# EAGLE schematic ESE323- 100kHz Oscilloscope Project_ (EAGLE 9.7.0)

## Sheet 1 of 4
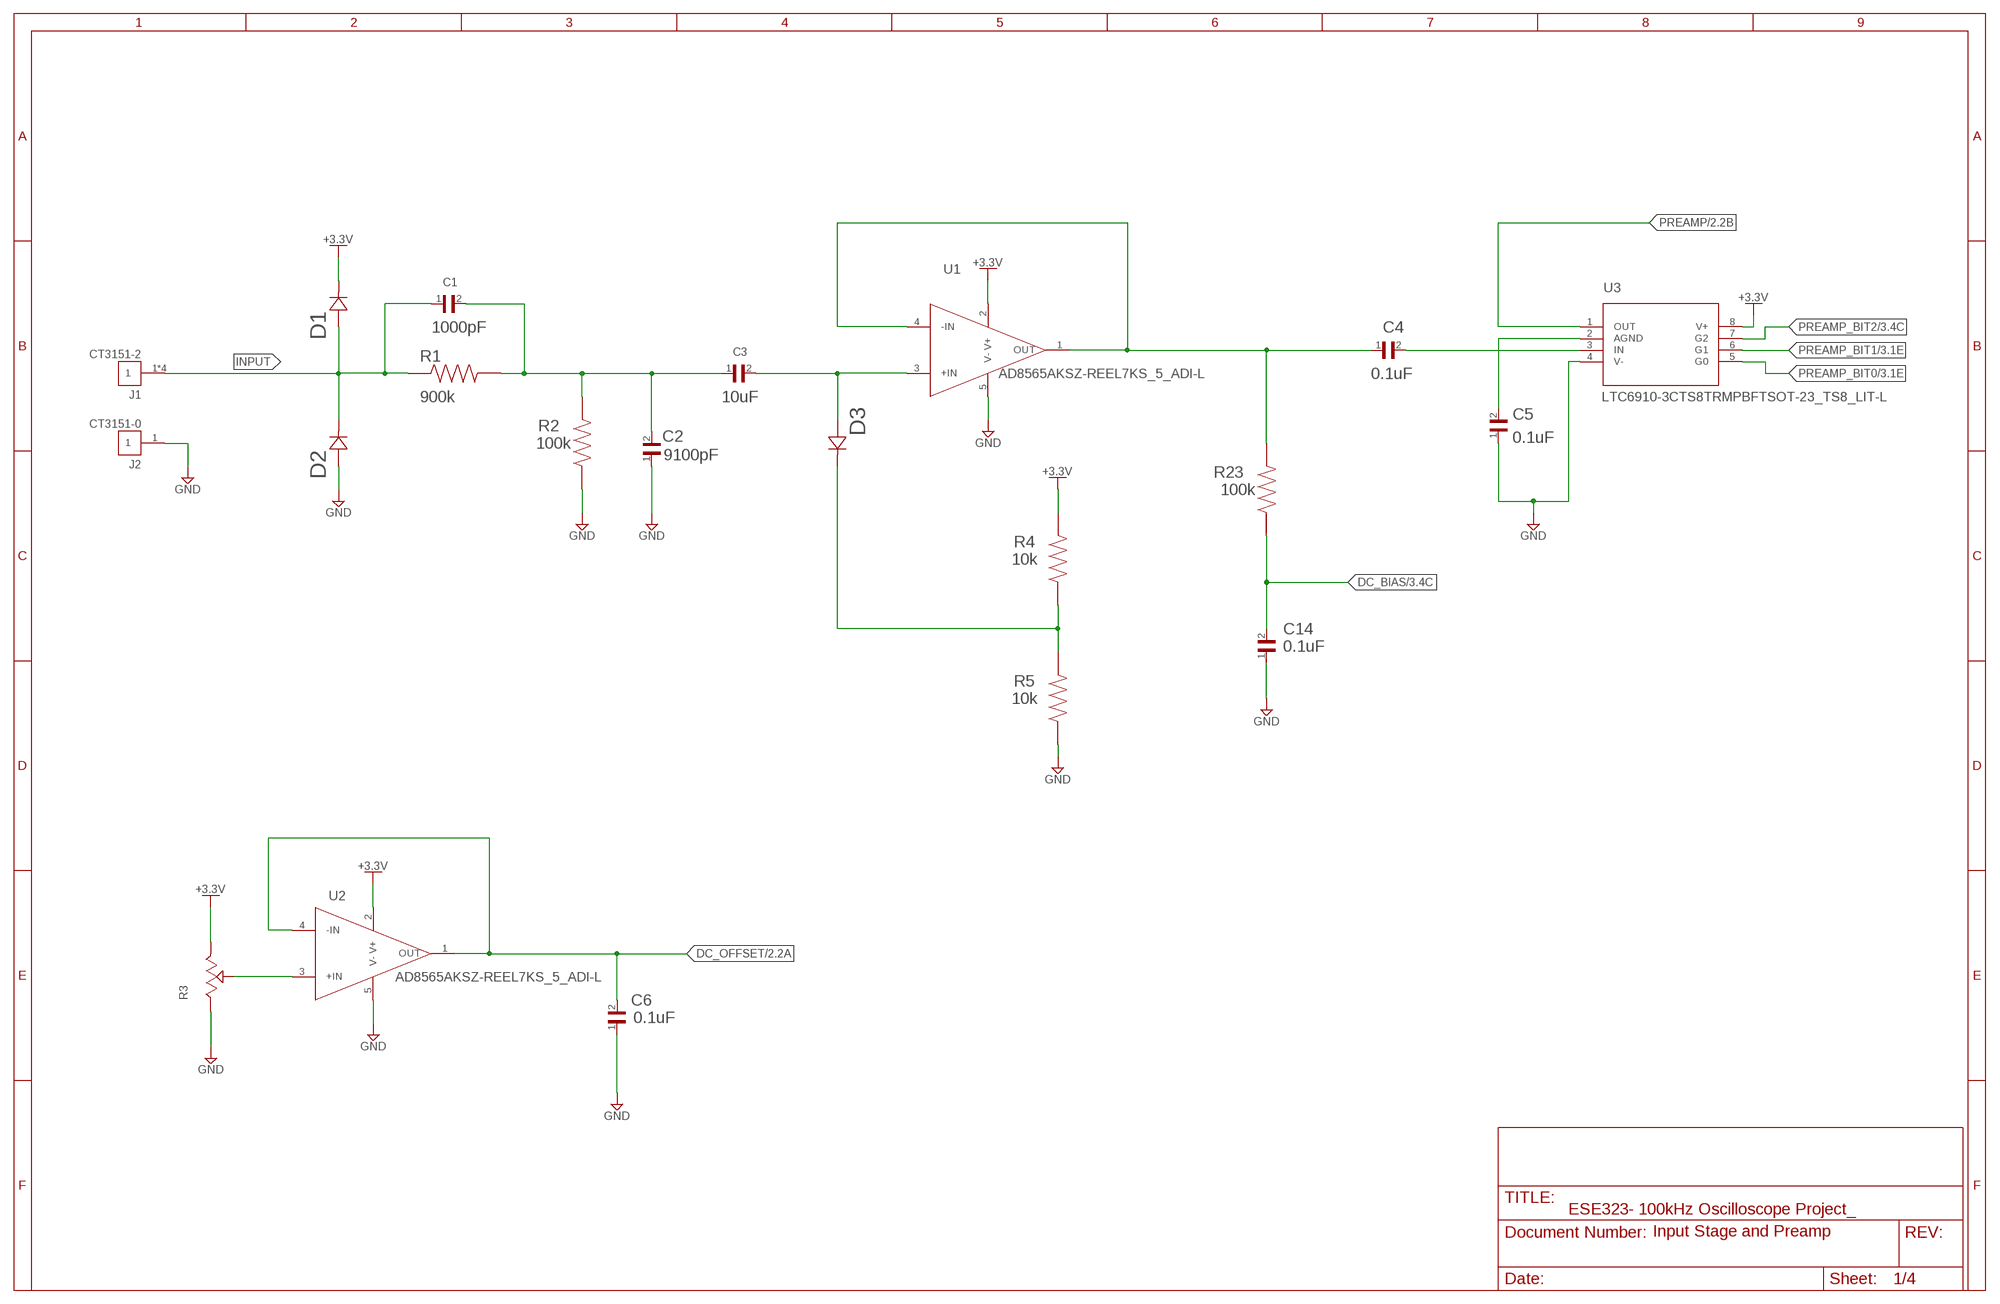
[diagram p0: schematic, sheet 1]

### Parts
C1  GRM2165C2A102JA01D  [GRM2165C2A102JA01D]
C2  GRM2195C1H912JA01D  [GRM2195C1H912JA01D]
C3  GRM188R61A106ME69D  [GRM188R61A106ME69D]
C4  GCJ188R71H104KA12D  [GCJ188R71H104KA12D]
C5  GRT188R61H105KE13D  [GCJ188R71H104KA12D]
C6  GCJ188R71H104KA12D  [GCJ188R71H104KA12D]
C14  GCJ188R71H104KA12D  [GCJ188R71H104KA12D]
D1  NSR05F40NXT5GCR_NSR05_ONS-L  [CR_NSR05_ONS-L]
D2  NSR05F40NXT5GCR_NSR05_ONS-L  [CR_NSR05_ONS-L]
D3  NSR05F40NXT5GCR_NSR05_ONS-L  [CR_NSR05_ONS-L]
J1  CT3151-2  [CALTEST_CT3151-2]
J2  CT3151-0  [CALTEST_CT3151-0]
R1  RT1206CRE07900KL  [RT1206CRE07900KL]
R2  ESR03EZPJ104  [ESR03EZPJ103]
R3  3386P-1-101TLF  [TRIM_3386P-1-101TLF]
R4  ESR03EZPJ103  [ESR03EZPJ103]
R5  ESR03EZPJ103  [ESR03EZPJ103]
R23  ESR03EZPJ104  [ESR03EZPJ103]
U1  AD8565AKSZ-REEL7KS_5_ADI-L  [AD8565-L]
U2  AD8565AKSZ-REEL7KS_5_ADI-L  [AD8565-L]
U3  LTC6910-3CTS8TRMPBFTSOT-23_TS8_LIT-L  [LTC6910-4-TSOT-23-L]

### Nets
+3.3V: D1.1 R3.3(CW) R4.2 U1.2(V+) U2.2(V+) U3.8(V+) ; also sheet 2,3,4
DC_BIAS: C14.2 R23.1 ; also sheet 3
DC_OFFSET: C6.2 U2.1(OUT) U2.4(-IN) ; also sheet 2,3
GND: C2.1 C5.1 C6.1 C14.1 D2.2 J2.1 R2.1 R3.1(CCW) R5.1 U1.5(V-) U2.5(V-) U3.4(V-) ; also sheet 2,3,4
INPUT: C1.1 D1.2 D2.1 J1.1 J1.2 J1.3 J1.4 R1.1
N$1: C4.2 U3.3(IN)
N$2: C3.2 D3.2 U1.3(+IN)
N$5: R3.2(WIPER) U2.3(+IN)
N$9: C1.2 C2.2 C3.1 R1.2 R2.2
N$10: C5.2 U3.2(AGND)
N$16: D3.1 R4.1 R5.2
N$23: C4.1 R23.2 U1.1(OUT) U1.4(-IN)
PREAMP: U3.1(OUT) ; also sheet 2
PREAMP_BIT0: U3.5(G0) ; also sheet 3
PREAMP_BIT1: U3.6(G1) ; also sheet 3
PREAMP_BIT2: U3.7(G2) ; also sheet 3

### Notes on the sheet
- 1000pF
- 0.1uF
- 900k | 10uF
- 0.1uF
- 100k
- 9100pF
- 100k
- 10k
- 0.1uF
- 10k
- 0.1uF
- Input Stage and Preamp

## Sheet 2 of 4
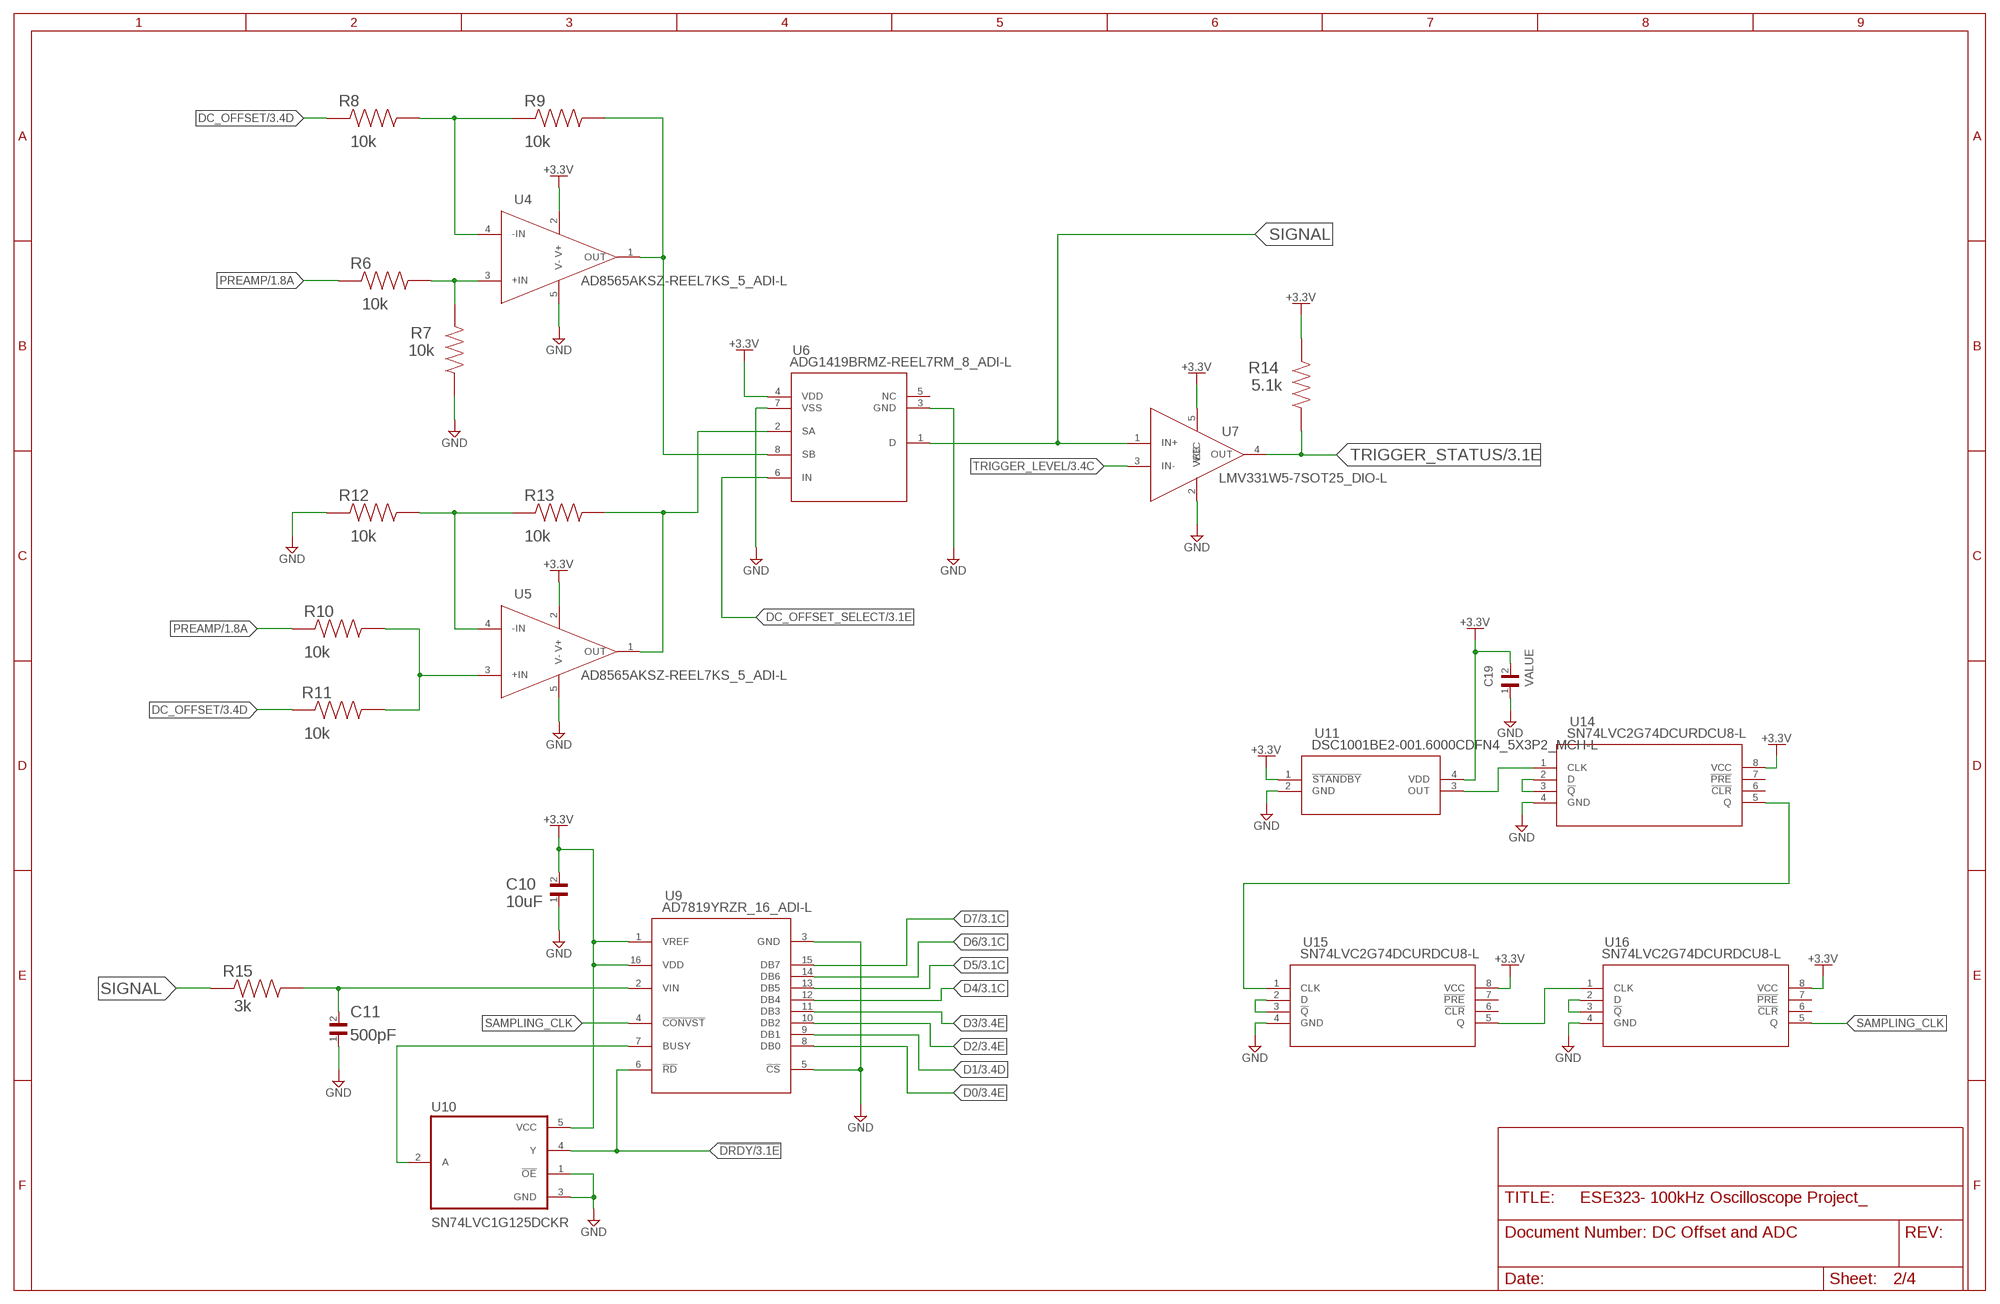
[diagram p1: schematic, sheet 2]

### Parts
C10  GRM188R61A106ME69D  [GRM188R61A106ME69D]
C11  CC0603JRNPO9BN501  [CC0603JRNPO9BN501]
C19  GCJ188R71H104KA12D  [GCJ188R71H104KA12D]
R6  ESR03EZPJ103  [ESR03EZPJ103]
R7  ESR03EZPJ103  [ESR03EZPJ103]
R8  ESR03EZPJ103  [ESR03EZPJ103]
R9  ESR03EZPJ103  [ESR03EZPJ103]
R10  ESR03EZPJ103  [ESR03EZPJ103]
R11  ESR03EZPJ103  [ESR03EZPJ103]
R12  ESR03EZPJ103  [ESR03EZPJ103]
R13  ESR03EZPJ103  [ESR03EZPJ103]
R14  RT0603DRE075K1L  [ESR03EZPJ103]
R15  ESR03EZPJ302  [ESR03EZPJ103]
U4  AD8565AKSZ-REEL7KS_5_ADI-L  [AD8565-L]
U5  AD8565AKSZ-REEL7KS_5_ADI-L  [AD8565-L]
U6  ADG1419BRMZ-REEL7RM_8_ADI-L  [ADG1419-L]
U7  LMV331W5-7SOT25_DIO-L  [LMV331-L]
U9  AD7819YRZR_16_ADI-L  [AD7819-L]
U10  SN74LVC1G125DCKR  [SN74LVC1G125DCKR-SOT65P210X110-5N]
U11  DSC1001BE2-001.6000CDFN4_5X3P2_MCH-L  [CDFN4_5X3P2_MCH-L]
U14  SN74LVC2G74DCURDCU8-L  [DCU8-L]
U15  SN74LVC2G74DCURDCU8-L  [DCU8-L]
U16  SN74LVC2G74DCURDCU8-L  [DCU8-L]

### Nets
!DRDY: U9.6(!RD) U10.4(Y) ; also sheet 3
+3.3V: C10.2 C19.2 R14.2 U4.2(V+) U5.2(V+) U6.4(VDD) U7.5(VCC) U9.1(VREF) U9.16(VDD) U10.5(VCC) U11.1(!STANDBY) U11.4(VDD) U14.8(VCC) U15.8(VCC) U16.8(VCC) ; also sheet 1,3,4
D0: U9.8(DB0) ; also sheet 3
D1: U9.9(DB1) ; also sheet 3
D2: U9.10(DB2) ; also sheet 3
D3: U9.11(DB3) ; also sheet 3
D4: U9.12(DB4) ; also sheet 3
D5: U9.13(DB5) ; also sheet 3
D6: U9.14(DB6) ; also sheet 3
D7: U9.15(DB7) ; also sheet 3
DC_OFFSET: R8.1 R11.1 ; also sheet 1,3
DC_OFFSET_SELECT: U6.6(IN) ; also sheet 3,4
GND: C10.1 C11.1 C19.1 R7.1 R12.1 U4.5(V-) U5.5(V-) U6.3(GND) U6.7(VSS) U7.2(VEE) U9.3(GND) U9.5(!CS) U10.1(!OE) U10.3(GND) U11.2(GND) U14.4(GND) U15.4(GND) U16.4(GND) ; also sheet 1,3,4
N$4: R6.2 R7.2 U4.3(+IN)
N$11: R8.2 R9.1 U4.4(-IN)
N$13: R10.2 R11.2 U5.3(+IN)
N$14: R12.2 R13.1 U5.4(-IN)
N$15: R9.2 U4.1(OUT) U6.8(SB)
N$17: R13.2 U5.1(OUT) U6.2(SA)
N$25: C11.2 R15.2 U9.2(VIN)
N$26: U9.7(BUSY) U10.2(A)
N$29: U14.2(D) U14.3(!Q)
N$30: U15.2(D) U15.3(!Q)
N$31: U16.2(D) U16.3(!Q)
N$32: U11.3(OUT) U14.1(CLK)
N$33: U14.5(Q) U15.1(CLK)
N$34: U15.5(Q) U16.1(CLK)
PREAMP: R6.1 R10.1 ; also sheet 1
SAMPLING_CLK: U9.4(!CONVST) U16.5(Q)
SIGNAL: R15.1 U6.1(D) U7.1(IN+)
TRIGGER_LEVEL: U7.3(IN-) ; also sheet 3,4
TRIGGER_STATUS: R14.1 U7.4(OUT) ; also sheet 3
Unconnected: U6.5(NC) U14.6(!CLR) U14.7(!PRE) U15.6(!CLR) U15.7(!PRE) U16.6(!CLR) U16.7(!PRE)

### Notes on the sheet
- 10k | 10k
- 10k
- 10k
- 5.1k
- 10k | 10k
- 10k
- 10k
- 10uF
- 3k
- 500pF
- DC Offset and ADC

## Sheet 3 of 4
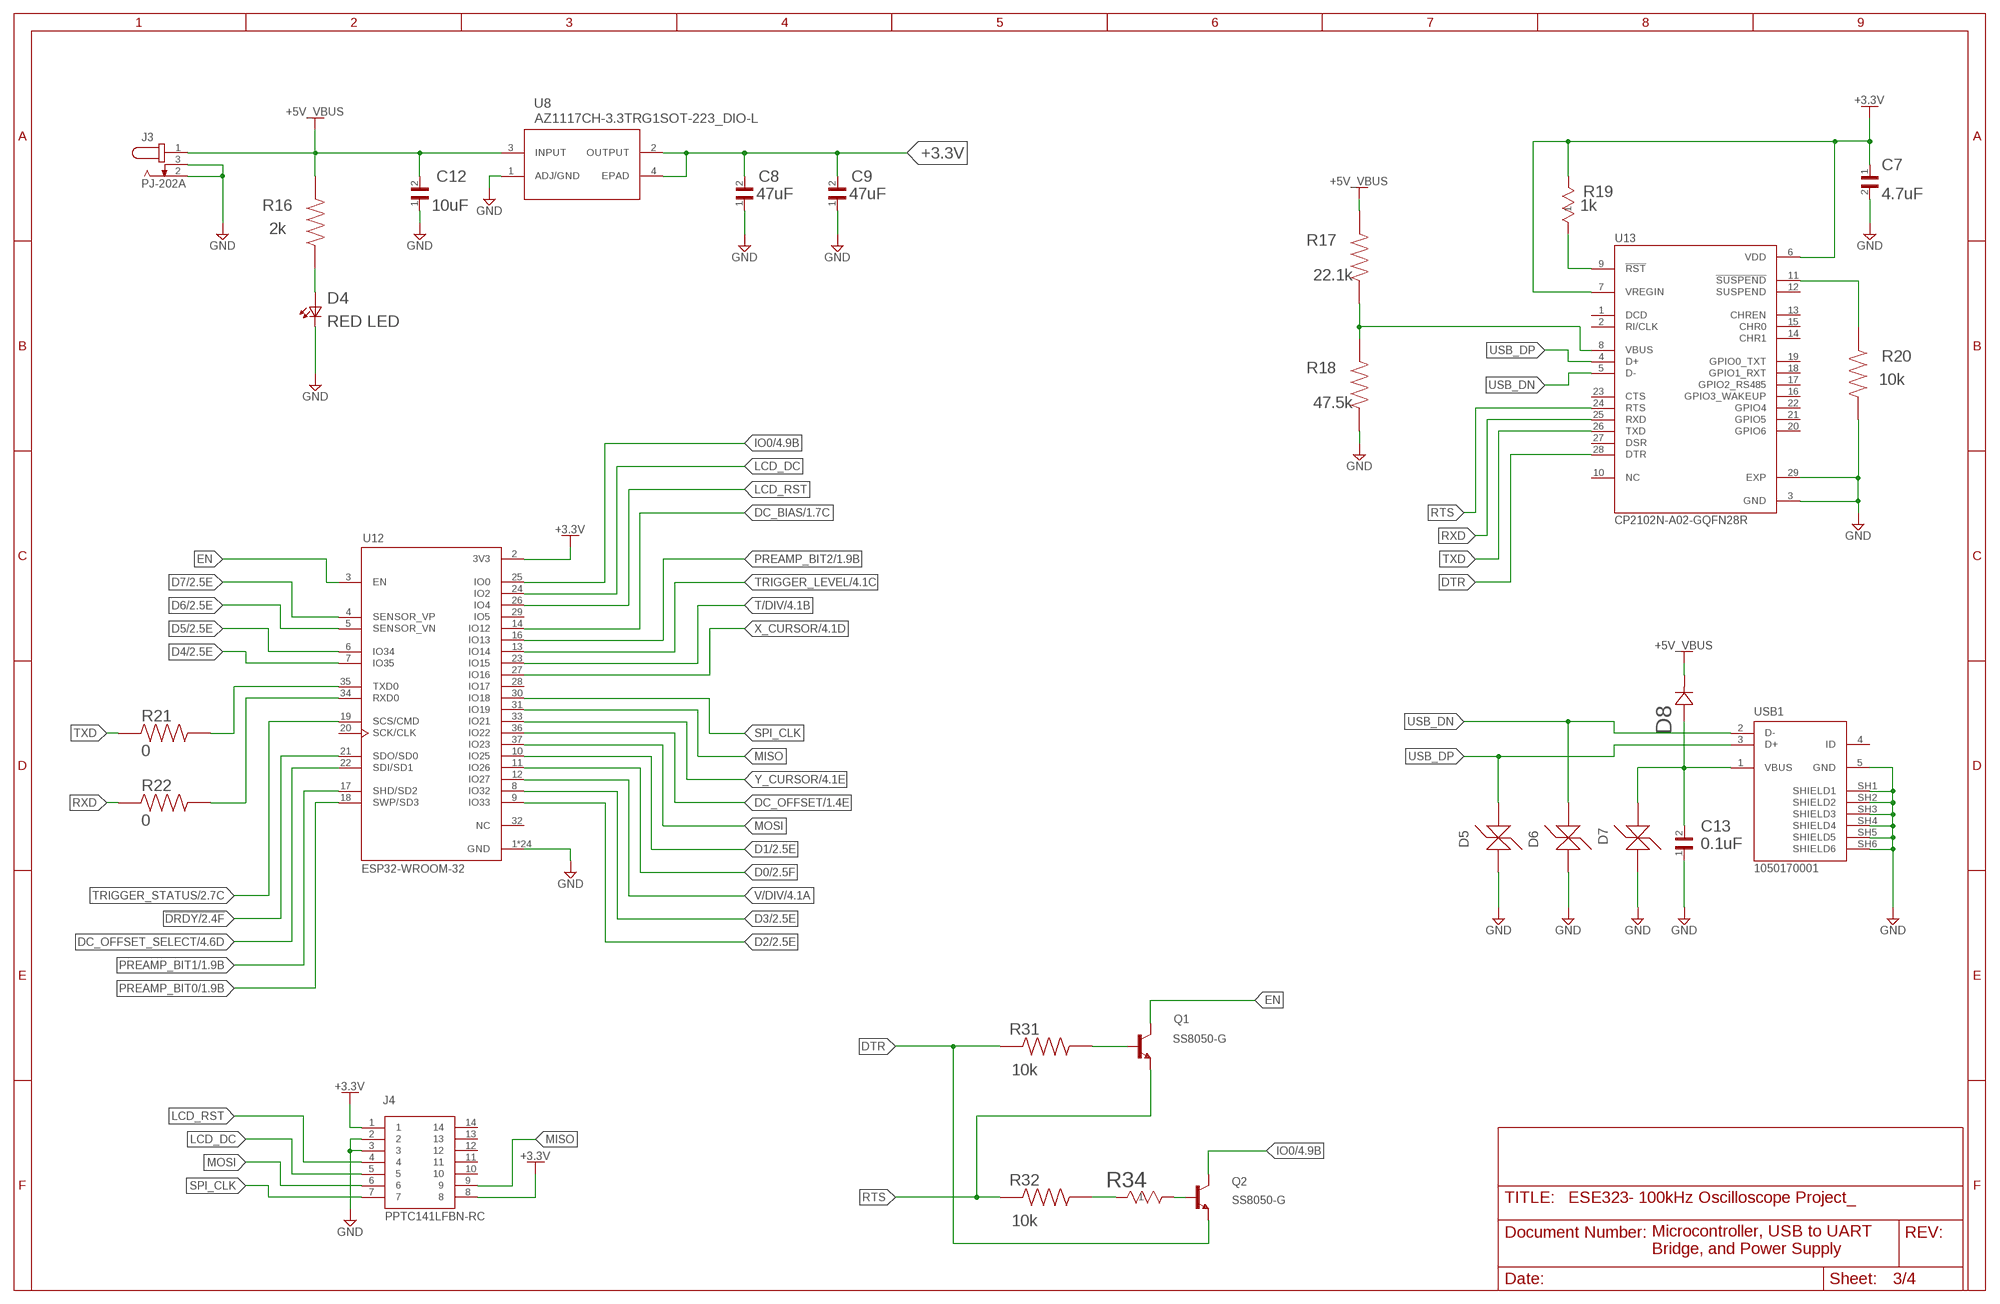
[diagram p2: schematic, sheet 3]

### Parts
C7  C0603C475K9PACTU  [CAPC1608X90]
C8  GRM188R60J476ME15J  [GRM188R60J476ME15J]
C9  GRM188R60J476ME15J  [GRM188R60J476ME15J]
C12  GRM188R61A106ME69D  [GRM188R61A106ME69D]
C13  GCJ188R71H104KA12D  [GCJ188R71H104KA12D]
D4  LTST-C191KRKT  [LTST-C191KRKT-0603]
D5  D5V0L1B2T-7SOD523_DIO-L  [D5V0L1B2T_7-SOD523_DIO-L]
D6  D5V0L1B2T-7SOD523_DIO-L  [D5V0L1B2T_7-SOD523_DIO-L]
D7  D5V0L1B2T-7SOD523_DIO-L  [D5V0L1B2T_7-SOD523_DIO-L]
D8  NSR05F40NXT5GCR_NSR05_ONS-L  [CR_NSR05_ONS-L]
J3  PJ-202A  [CUI_PJ-202A]
J4  PPTC141LFBN-RC  [PPTC141LFBN-RC]
Q1  SS8050-G  [TRANS_SS8050-G]
Q2  SS8050-G  [TRANS_SS8050-G]
R16  ESR03EZPJ202  [ESR03EZPJ202]
R17  RNCP0603FTD22K1  [RNCP0603FTD22K1]
R18  RNCF0603DTE47K5  [RNCF0603DTE47K5]
R19  RNCP0603FTD1K00STA_RNCP0603_STP-L  [STA_RNCP0603_STP-L]
R20  ESR03EZPJ103  [ESR03EZPJ103]
R21  RMCF0603ZT0R00  [RMCF0603ZT0R00]
R22  RMCF0603ZT0R00  [RMCF0603ZT0R00]
R31  ESR03EZPJ103  [ESR03EZPJ103]
R32  ESR03EZPJ103  [ESR03EZPJ103]
R34  CD14ZT0R00STA_CD14_STP  [STA_CD14_STP]
U8  AZ1117CH-3.3TRG1SOT-223_DIO-L  [AZ1117CH-3.3TRG1-SOT-223_DIO-L]
U12  ESP32-WROOM-32  [MODULE_ESP32-WROOM-32]
U13  CP2102N-A02-GQFN28R  [IC_CP2102N-A02-GQFN28R]
USB1  1050170001  [MOLEX_1050170001]

### Nets
!DRDY: U12.21(SDO/SD0) ; also sheet 2
+3.3V: C7.1 C8.2 C9.2 J4.1 J4.8 R19.2 U8.2(OUTPUT) U8.4(EPAD) U12.2(3V3) U13.6(VDD) U13.7(VREGIN) ; also sheet 1,2,4
+5V_VBUS: C12.2 D8.1 J3.1 R16.2 R17.2 U8.3(INPUT)
D0: U12.11(IO26) ; also sheet 2
D1: U12.10(IO25) ; also sheet 2
D2: U12.9(IO33) ; also sheet 2
D3: U12.8(IO32) ; also sheet 2
D4: U12.7(IO35) ; also sheet 2
D5: U12.6(IO34) ; also sheet 2
D6: U12.5(SENSOR_VN) ; also sheet 2
D7: U12.4(SENSOR_VP) ; also sheet 2
DC_BIAS: U12.14(IO12) ; also sheet 1
DC_OFFSET: U12.36(IO22) ; also sheet 1,2
DC_OFFSET_SELECT: U12.22(SDI/SD1) ; also sheet 2,4
DTR: Q2.2(E) R31.1 U13.28(DTR)
EN: Q1.3(C) U12.3(EN) ; also sheet 4
GND: C7.2 C8.1 C9.1 C12.1 C13.1 D4.1(K2) D5.1(EPAD_2) D6.1(EPAD_2) D7.1(EPAD_2) J3.2 J3.3 J4.2 J4.3 R18.1 R20.2 U8.1(ADJ/GND) U12.1(GND) U12.15(GND) U12.38(GND) U12.39_1(GND) U12.39_2(GND) U12.39_3(GND) U12.39_4(GND) U12.39_5(GND) U12.39_6(GND) U12.39_7(GND) U12.39_8(GND) U12.39_9(GND) U12.39_10(GND) U12.39_11(GND) U12.39_12(GND) U12.39_13(GND) U12.39_14(GND) U12.39_15(GND) U12.39_16(GND) U12.39_17(GND) U12.39_18(GND) U12.39_19(GND) U12.39_20(GND) U12.39_21(GND) U13.3(GND) U13.29(EXP) USB1.5(GND) USB1.SH1(SHIELD1) USB1.SH2(SHIELD2) USB1.SH3(SHIELD3) USB1.SH4(SHIELD4) USB1.SH5(SHIELD5) USB1.SH6(SHIELD6) ; also sheet 1,2,4
IO0: Q2.3(C) U12.25(IO0) ; also sheet 4
LCD_DC: J4.5 U12.24(IO2)
LCD_RST: J4.4 U12.26(IO4)
MISO: J4.9 U12.31(IO19)
MOSI: J4.6 U12.37(IO23)
N$8: Q1.1(B) R31.2
N$12: D4.2(A2) R16.1
N$18: R17.1 R18.2 U13.8(VBUS)
N$19: R32.2 R34.1
N$20: R19.1 U13.9(!RST)
N$21: R20.1 U13.11(!SUSPEND)
N$22: Q2.1(B) R34.2
N$24: R22.2 U12.34(RXD0)
N$27: R21.2 U12.35(TXD0)
N$28: C13.2 D7.2(EPAD) D8.2 USB1.1(VBUS)
PREAMP_BIT0: U12.18(SWP/SD3) ; also sheet 1
PREAMP_BIT1: U12.17(SHD/SD2) ; also sheet 1
PREAMP_BIT2: U12.16(IO13) ; also sheet 1
RTS: Q1.2(E) R32.1 U13.24(RTS)
RXD: R22.1 U13.25(RXD)
SPI_CLK: J4.7 U12.30(IO18)
T/DIV: U12.23(IO15) ; also sheet 4
TRIGGER_LEVEL: U12.13(IO14) ; also sheet 2,4
TRIGGER_STATUS: U12.19(SCS/CMD) ; also sheet 2
TXD: R21.1 U13.26(TXD)
USB_DN: D6.2(EPAD) U13.5(D-) USB1.2(D-)
USB_DP: D5.2(EPAD) U13.4(D+) USB1.3(D+)
V/DIV: U12.12(IO27) ; also sheet 4
X_CURSOR: U12.27(IO16) ; also sheet 4
Y_CURSOR: U12.33(IO21) ; also sheet 4
Unconnected: J4.10 J4.11 J4.12 J4.13 J4.14 U12.20(SCK/CLK) U12.28(IO17) U12.29(IO5) U12.32(NC) U13.1(DCD) U13.2(RI/CLK) U13.10(NC) U13.12(SUSPEND) U13.13(CHREN) U13.14(CHR1) U13.15(CHR0) U13.16(GPIO3_WAKEUP) U13.17(GPIO2_RS485) U13.18(GPIO1_RXT) U13.19(GPIO0_TXT) U13.20(GPIO6) U13.21(GPIO5) U13.22(GPIO4) U13.23(CTS) U13.27(DSR) USB1.4(ID)

### Notes on the sheet
- 47uF | 47uF | 4.7uF
- 10uF | 1k
- 2k
- 22.1k
- RED LED
- 10k
- 47.5k
- 0
- 0
- 0.1uF
- 10k
- 10k
- Microcontroller, USB to UART
  Bridge, and Power Supply

## Sheet 4 of 4
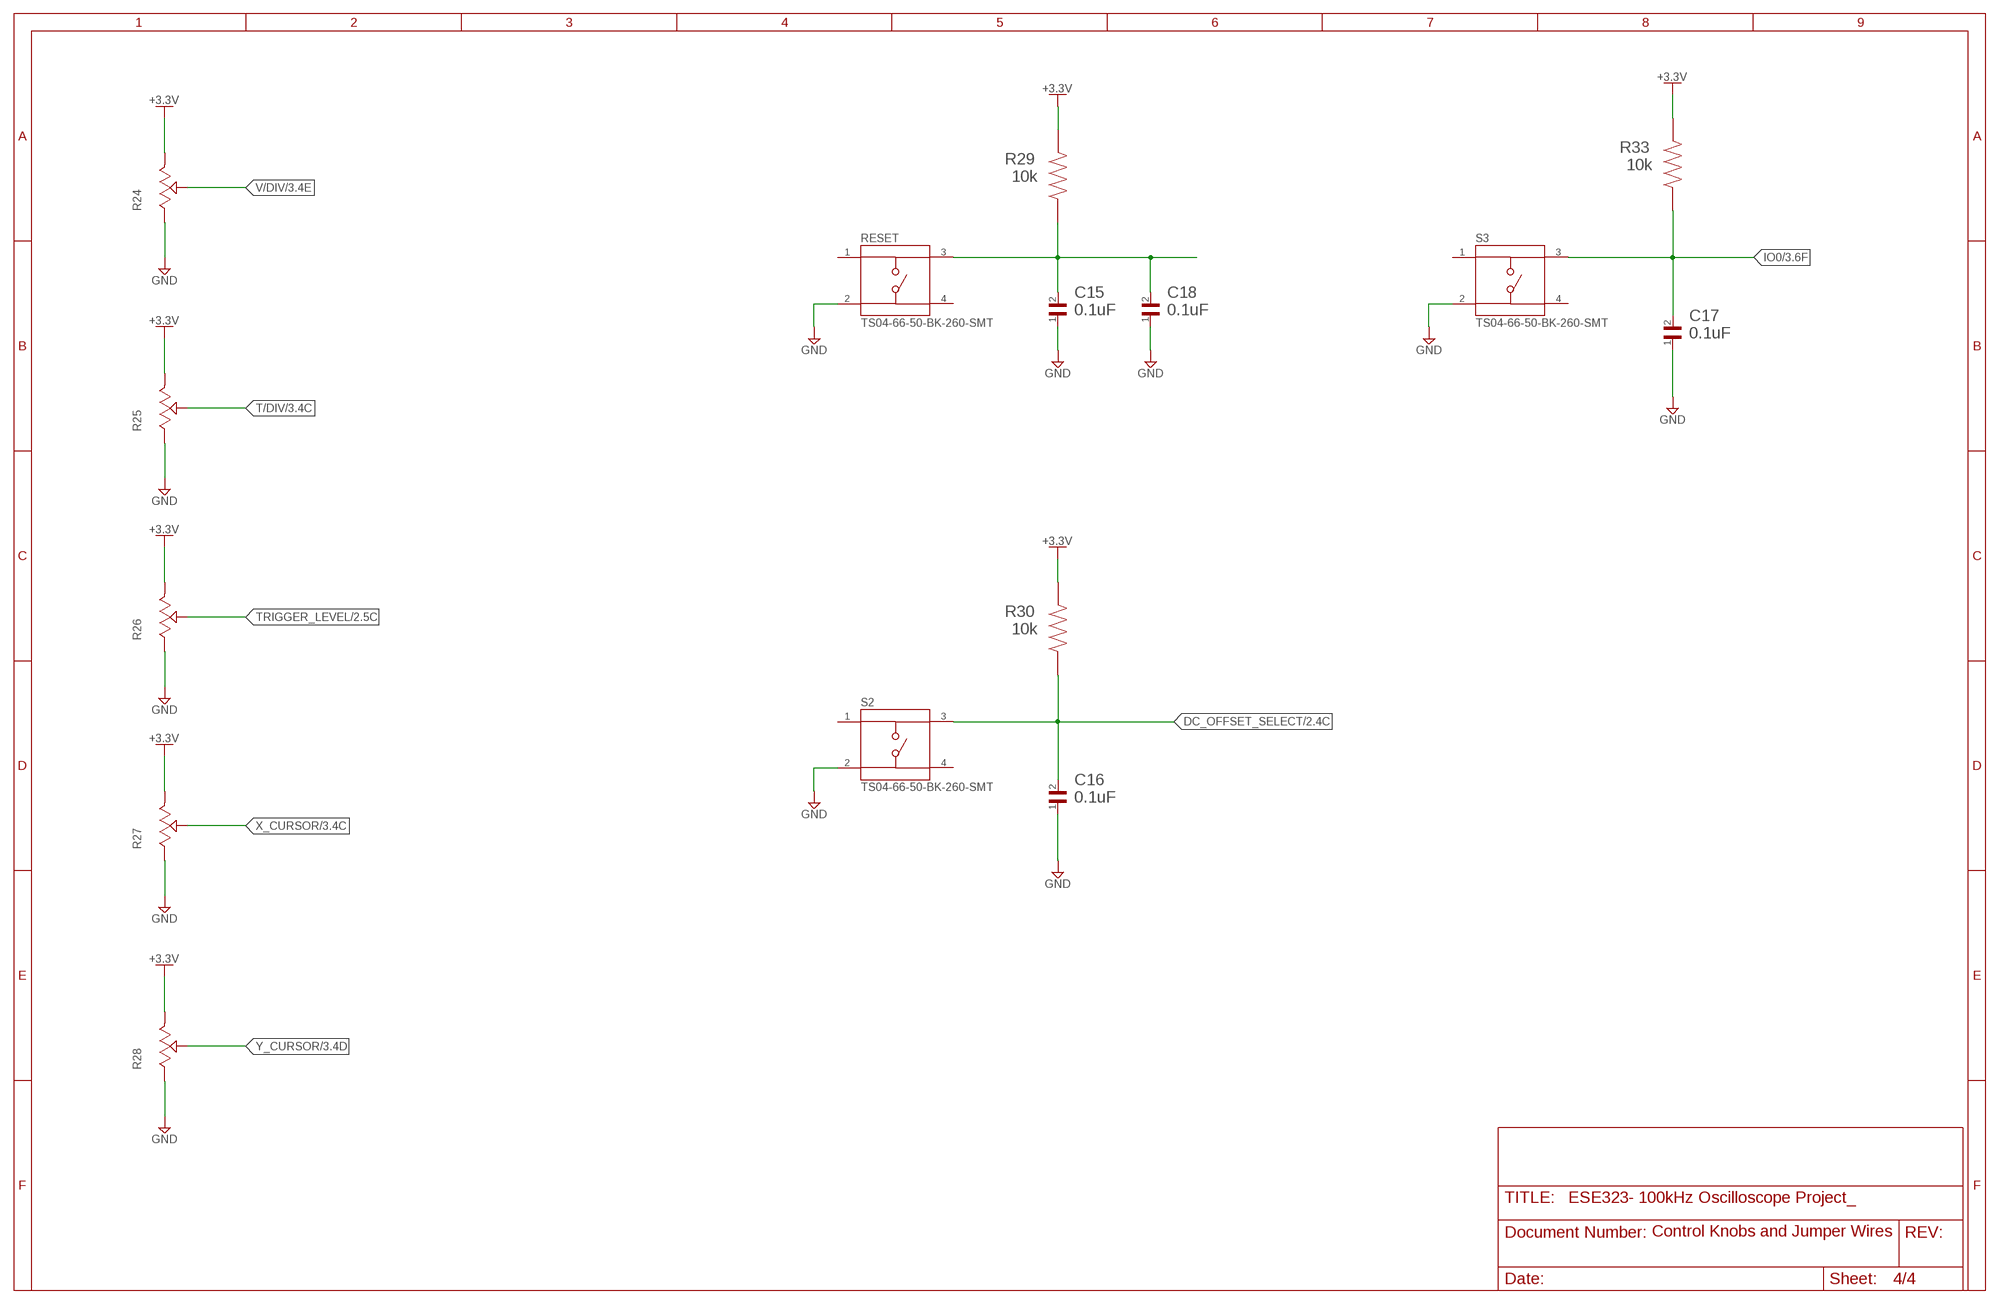
[diagram p3: schematic, sheet 4]

### Parts
C15  GCJ188R71H104KA12D  [GCJ188R71H104KA12D]
C16  GCJ188R71H104KA12D  [GCJ188R71H104KA12D]
C17  GCJ188R71H104KA12D  [GCJ188R71H104KA12D]
C18  GCJ188R71H104KA12D  [GCJ188R71H104KA12D]
R24  3386P-1-101TLF  [TRIM_3386P-1-101TLF]
R25  3386P-1-101TLF  [TRIM_3386P-1-101TLF]
R26  3386P-1-101TLF  [TRIM_3386P-1-101TLF]
R27  3386P-1-101TLF  [TRIM_3386P-1-101TLF]
R28  3386P-1-101TLF  [TRIM_3386P-1-101TLF]
R29  ESR03EZPJ103  [ESR03EZPJ103]
R30  ESR03EZPJ103  [ESR03EZPJ103]
R33  ESR03EZPJ103  [ESR03EZPJ103]
RESET  TS04-66-50-BK-260-SMT  [SW_TS04-66-50-BK-260-SMT]
S2  TS04-66-50-BK-260-SMT  [SW_TS04-66-50-BK-260-SMT]
S3  TS04-66-50-BK-260-SMT  [SW_TS04-66-50-BK-260-SMT]

### Nets
+3.3V: R24.3(CW) R25.3(CW) R26.3(CW) R27.3(CW) R28.3(CW) R29.2 R30.2 R33.2 ; also sheet 1,2,3
DC_OFFSET_SELECT: C16.2 R30.1 S2.3 ; also sheet 2,3
EN: C15.2 C18.2 R29.1 RESET.3 ; also sheet 3
GND: C15.1 C16.1 C17.1 C18.1 R24.1(CCW) R25.1(CCW) R26.1(CCW) R27.1(CCW) R28.1(CCW) RESET.2 S2.2 S3.2 ; also sheet 1,2,3
IO0: C17.2 R33.1 S3.3 ; also sheet 3
T/DIV: R25.2(WIPER) ; also sheet 3
TRIGGER_LEVEL: R26.2(WIPER) ; also sheet 2,3
V/DIV: R24.2(WIPER) ; also sheet 3
X_CURSOR: R27.2(WIPER) ; also sheet 3
Y_CURSOR: R28.2(WIPER) ; also sheet 3
Unconnected: RESET.1 RESET.4 S2.1 S2.4 S3.1 S3.4

### Notes on the sheet
- 10k
- 10k
- 0.1uF | 0.1uF
- 0.1uF
- 10k
- 0.1uF
- Control Knobs and Jumper Wires

## Library data of the parts
C1 = ESE323_Project_Library:GRM2165C2A102JA01D: 0805 1000 pF 100 V ±5% Tolerance C0G Multilayer Ceramic Capacitor; CHECK_PRICES: https://www.snapeda.com/parts/GRM2165C2A102JA01D/Murata+Electronics+North+America/view-part/?ref=eda; DESCRIPTION: 0805 1000 pF 100 V ±5% Tolerance C0G Multilayer Ceramic Capacitor; DIGIKEY_PART_NUMBER: 490-6445-2-ND; MF: Murata Electronics; MP: GRM2165C2A102JA01D; PACKAGE: 2012 Murata; PURCHASE-URL: https://www.snapeda.com/api/url_track_click_mouser/?unipart_id=1837721&manufacturer=Murata Electronics&part_name=GRM2165C2A102JA01D&search_term=None; SNAPEDA_LINK: https://www.snapeda.com/parts/GRM2165C2A102JA01D/Murata+Electronics+North+America/view-part/?ref=snap
C2 = ESE323_Project_Library:GRM2195C1H912JA01D: SMD Capacitor C0G(EIA) with Capacitance: 9100pF Tol. 5%. Rated Voltage: 50Vdc
C3 C10 C12 = ESE323_Project_Library:GRM188R61A106ME69D: SMD Capacitor X5R(EIA) with Capacitance: 10uF Tol. 20%. Rated Voltage: 10Vdc; CHECK_PRICES: https://www.snapeda.com/parts/GRM188R61A106ME69D/Murata+Electronics+North+America/view-part/?ref=eda; DESCRIPTION: SMD capacitor X5R(EIA) with capacitance 10uF Tol.20%. Rated voltage 10Vdc 85C; DIGIKEY_PART_NUMBER: 490-10475-2-ND; MF: Murata; MP: GRM188R61A106ME69D; PACKAGE: 1608 Murata; PURCHASE-URL: https://www.snapeda.com/api/url_track_click_mouser/?unipart_id=589707&manufacturer=Murata&part_name=GRM188R61A106ME69D&search_term=None; SNAPEDA_LINK: https://www.snapeda.com/parts/GRM188R61A106ME69D/Murata+Electronics+North+America/view-part/?ref=snap
C4 C6 C13-C19 = ESE323_Project_Library:GCJ188R71H104KA12D; CHECK_PRICES: https://www.snapeda.com/parts/GCJ188R71H104KA12D/Murata+Electronics+North+America/view-part/?ref=eda; DESCRIPTION: 0.1 µF ±10% 50V Ceramic Capacitor X7R 0603 (1608 Metric); DIGIKEY_PART_NUMBER: 490-5798-2-ND; MF: Murata Electronics; MP: GCJ188R71H104KA12D; PACKAGE: 1608 Murata; PURCHASE-URL: https://www.snapeda.com/api/url_track_click_mouser/?unipart_id=667734&manufacturer=Murata Electronics&part_name=GCJ188R71H104KA12D&search_term=None; SNAPEDA_LINK: https://www.snapeda.com/parts/GCJ188R71H104KA12D/Murata+Electronics+North+America/view-part/?ref=snap
C5 = ESE323_Project_Library:GRT188R61H105KE13D: Cap Ceramic 1uF 50V X5R 10% Pad SMD 0603 85C Automotive T/R Check availability <https://pricing.snapeda.com/parts/GRT188R61H105KE13D/Murata/view-part?ref=eda>; CHECK_PRICES: https://www.snapeda.com/parts/GRT188R61H105KE13D/Murata+Electronics+North+America/view-part/?ref=eda; DESCRIPTION: 1 µF ±10% 50V Ceramic Capacitor X5R 0603 (1608 Metric); DIGIKEY_PART_NUMBER: 490-12330-2-ND; MF: Murata; MP: GRT188R61H105KE13D; PACKAGE: 1608 Murata; PURCHASE-URL: https://www.snapeda.com/api/url_track_click_mouser/?unipart_id=1767599&manufacturer=Murata&part_name=GRT188R61H105KE13D&search_term=None; SNAPEDA_LINK: https://www.snapeda.com/parts/GRT188R61H105KE13D/Murata+Electronics+North+America/view-part/?ref=snap
C7 = ESE323_Project_Library:C0603C475K9PACTU: CERAMIC CAPACITOR 4.7UF, 6.3V, X5R, 10%, 0603; CHECK_PRICES: https://www.snapeda.com/parts/C0603C475K9PACTU/KEMET/view-part/?ref=eda; DESCRIPTION: 0603 C 4.7uF Ceramic Multilayer Capacitor, 6.3 VDC, +85degC, X5R Dielec, +/-10% | KEMET C0603C475K9PACTU; MF: KEMET; MP: C0603C475K9PACTU; PACKAGE: 0603 Kemet; SNAPEDA_LINK: https://www.snapeda.com/parts/C0603C475K9PACTU/KEMET/view-part/?ref=snap
C8 C9 = ESE323_Project_Library:GRM188R60J476ME15J: SMD Capacitor X5R(EIA) with Capacitance: 47uF Tol. 20%. Rated Voltage: 6.3Vdc; CHECK_PRICES: https://www.snapeda.com/parts/GRM188R60J476ME15J/Murata/view-part/?ref=eda; DESCRIPTION: SMD capacitor X5R(EIA) with capacitance 47uF Tol.20%. Rated voltage 6.3Vdc 85C; DIGIKEY_PART_NUMBER: 490-GRM188R60J476ME15JTR-ND; MF: Murata; MP: GRM188R60J476ME15J; PACKAGE: 1608 Murata; PURCHASE-URL: https://www.snapeda.com/api/url_track_click_mouser/?unipart_id=1988705&manufacturer=Murata&part_name=GRM188R60J476ME15J&search_term=None; SNAPEDA_LINK: https://www.snapeda.com/parts/GRM188R60J476ME15J/Murata/view-part/?ref=snap
C11 = ESE323_Project_Library:CC0603JRNPO9BN501: CAP CER 500PF 50V NPO 0603; CHECK_PRICES: https://www.snapeda.com/parts/CC0603JRNPO9BN501/Yageo/view-part/?ref=eda; DESCRIPTION: 500 pF ±5% 50V Ceramic Capacitor C0G, NP0 0603 (1608 Metric); DIGIKEY_PART_NUMBER: 13-CC0603JRNPO9BN501TR-ND; MF: Yageo; MP: CC0603JRNPO9BN501; PACKAGE: 0603 Yageo; PURCHASE-URL: https://www.snapeda.com/api/url_track_click_mouser/?unipart_id=1822519&manufacturer=Yageo&part_name=CC0603JRNPO9BN501&search_term=None; SNAPEDA_LINK: https://www.snapeda.com/parts/CC0603JRNPO9BN501/Yageo/view-part/?ref=snap
D1-D3 D8 = ESE323_Project_Library:NSR05F40NXT5G; COPYRIGHT: Copyright (C) 2023 Ultra Librarian. All rights reserved.; MANUFACTURER_PART_NUMBER: NSR05F40NXT5G; MFR_NAME: onsemi
D4 = ESE323_Project_Library:LTST-C191KRKT: http://octopart.com/ltst-c190krkt-lite-on-549893; CHECK_PRICES: https://www.snapeda.com/parts/LTST-C191KRKT/Lite-On+Inc./view-part/?ref=eda; DESCRIPTION: Red 631nm LED Indication - Discrete 2V 0603 (1608 Metric); DIGIKEY_PART_NUMBER: 160-1447-2-ND; MF: Lite-On Inc.; MP: LTST-C191KRKT; PACKAGE: 0603 Lite-On Inc.; PURCHASE-URL: https://www.snapeda.com/api/url_track_click_mouser/?unipart_id=234319&manufacturer=Lite-On Inc.&part_name=LTST-C191KRKT&search_term=None; SNAPEDA_LINK: https://www.snapeda.com/parts/LTST-C191KRKT/Lite-On+Inc./view-part/?ref=snap
D5-D7 = ESE323_Project_Library:D5V0L1B2T-7; COPYRIGHT: Copyright (C) 2023 Ultra Librarian. All rights reserved.; MANUFACTURER_PART_NUMBER: D5V0L1B2T-7; MFR_NAME: Diodes Inc
J1 = ESE323_Project_Library:CT3151-2: Banana Jack Connector Standard Banana Solder Red; CHECK_PRICES: https://www.snapeda.com/parts/CT3151-2/Cal+Test+Electronics/view-part/?ref=eda; DESCRIPTION: Banana Jack Connector Standard Banana Solder Red; DIGIKEY_PART_NUMBER: BKCT3151-2-ND; MF: Cal Test; MP: CT3151-2; PACKAGE: None; PURCHASE-URL: https://www.snapeda.com/api/url_track_click_mouser/?unipart_id=552573&manufacturer=Cal Test&part_name=CT3151-2&search_term=None; SNAPEDA_LINK: https://www.snapeda.com/parts/CT3151-2/Cal+Test+Electronics/view-part/?ref=snap
J2 = ESE323_Project_Library:CT3151-0: Banana Jack Connector Standard Banana Solder Red
J3 = ESE323_Project_Library:PJ-202A: 2.0 mm Center Pin, 2.5 A, Right Angle, Through Hole, Kinked Pins, Dc Power Jack Connector Check availability <https://pricing.snapeda.com/parts/PJ-202A/CUI%20Devices/view-part?ref=eda>; CHECK_PRICES: https://www.snapeda.com/parts/PJ-202A/CUI+Devices/view-part/?ref=eda; CUI_PURCHASE_URL: https://www.cuidevices.com/product/interconnect/connectors/dc-power-connectors/jacks/pj-202a?utm_source=snapeda.com&utm_medium=referral&utm_campaign=snapedaBOM; DESCRIPTION: 2.0 x 6.5 mm, 2.5 A, Horizontal, Through Hole, Kinked Pins, Dc Power Jack Connector; DIGIKEY_PART_NUMBER: CP-202A-ND; MF: CUI Devices; MP: PJ-202A; PACKAGE: None; PURCHASE-URL: https://www.snapeda.com/api/url_track_click_mouser/?unipart_id=153805&manufacturer=CUI Devices&part_name=PJ-202A&search_term=None; SNAPEDA_LINK: https://www.snapeda.com/parts/PJ-202A/CUI+Devices/view-part/?ref=snap
J4 = ESE323_Project_Library:PPTC141LFBN-RC: 05 MODII HDR SRST B/A .100CL Check availability <https://pricing.snapeda.com/parts/5-146280-5/TE%20Connectivity/view-part?ref=eda>; AVAILABILITY: In Stock; CENTERLINE_PITCH: 2.54 mm[.1 in]; CHECK_PRICES: https://www.snapeda.com/parts/5-146280-5/TE+Connectivity+AMP+Connectors/view-part/?ref=eda; COMMENT: 5-146280-5; DESCRIPTION: Conn Unshrouded Header HDR 5 POS 2.54mm Solder ST Thru-Hole Carton; EU_ROHS_COMPLIANCE: Compliant; MF: TE Connectivity; MP: 5-146280-5; NUMBER_OF_POSITIONS: 5; PACKAGE: None; PRICE: None; PRODUCT_TYPE: Connector; PURCHASE-URL: https://www.snapeda.com/api/url_track_click_mouser/?unipart_id=700092&manufacturer=TE Connectivity&part_name=5-146280-5&search_term=None; SNAPEDA_LINK: https://www.snapeda.com/parts/5-146280-5/TE+Connectivity+AMP+Connectors/view-part/?ref=snap
Q1 Q2 = ESE323_Project_Library:SS8050-G: Bipolar (BJT) Transistor NPN 25 V 1.5 A 100MHz 300 mW Surface Mount SOT-23-3; CHECK_PRICES: https://www.snapeda.com/parts/SS8050-G/Comchip+Technology/view-part/?ref=eda; DESCRIPTION: Bipolar (BJT) Transistor NPN 25 V 1.5 A 100MHz 300 mW Surface Mount SOT-23-3; DIGIKEY_PART_NUMBER: 641-1790-2-ND; MF: Comchip Technology; MP: SS8050-G; PACKAGE: TO-236 Comchip; PURCHASE-URL: https://www.snapeda.com/api/url_track_click_mouser/?unipart_id=809142&manufacturer=Comchip Technology&part_name=SS8050-G&search_term=None; SNAPEDA_LINK: https://www.snapeda.com/parts/SS8050-G/Comchip+Technology/view-part/?ref=snap
R1 = ESE323_Project_Library:RT1206CRE07900KL
R2 R23 = ESE323_Project_Library:ESR03EZPJ104: RES ANTI-SURGE 0603 100K OHM 1/4W 5% SMD
R3 R24-R28 = ESE323_Project_Library:3386P-1-101TLF; MANUFACTURER: Bourns; MAXIMUM_PACKAGE_HEIGHT: 4.83 mm; PARTREV: 08/19; SNAPEDA_PN: 3386P-1-101TLF; STANDARD: IPC 7351B
R4-R13 R20 R29-R33 = ESE323_Project_Library:ESR03EZPJ103: Res Thick Film 0603 10K Ohm 5% 1/4W }200ppm/ Molded SMD SMD Paper T/R
R14 = ESE323_Project_Library:RT0603DRE075K1L; CHECK_PRICES: https://www.snapeda.com/parts/RT0603DRE075K1L/Yageo/view-part/?ref=eda; DESCRIPTION: Res Thin Film 0603 5.1K Ohm 0.5% 0.1W(1/10W) ±50ppm/°C Pad SMD T/R; DIGIKEY_PART_NUMBER: 311-2632-2-ND; MF: Yageo; MP: RT0603DRE075K1L; PACKAGE: 1608 Yageo; PURCHASE-URL: https://www.snapeda.com/api/url_track_click_mouser/?unipart_id=3854407&manufacturer=Yageo&part_name=RT0603DRE075K1L&search_term=None; SNAPEDA_LINK: https://www.snapeda.com/parts/RT0603DRE075K1L/Yageo/view-part/?ref=snap
R15 = ESE323_Project_Library:ESR03EZPJ302: RES SMD 3K OHM 5% 1/4W 0603; CHECK_PRICES: https://www.snapeda.com/parts/ESR03EZPJ302/Rohm/view-part/?ref=eda; DESCRIPTION: 3 kOhms ±5% 0.25W, 1/4W Chip Resistor 0603 (1608 Metric) Automotive AEC-Q200, Pulse Withstanding Thick Film; DIGIKEY_PART_NUMBER: RHM3KDTR-ND; MF: Rohm; MP: ESR03EZPJ302; PACKAGE: 1608 Rohm Semiconductor; PURCHASE-URL: https://www.snapeda.com/api/url_track_click_mouser/?unipart_id=975412&manufacturer=Rohm&part_name=ESR03EZPJ302&search_term=None; SNAPEDA_LINK: https://www.snapeda.com/parts/ESR03EZPJ302/Rohm/view-part/?ref=snap
R16 = ESE323_Project_Library:ESR03EZPJ202: RES ANTI-SURGE 0603 2K OHM 1/4W 5% SMD; CHECK_PRICES: https://www.snapeda.com/parts/ESR03EZPJ202/Rohm/view-part/?ref=eda; DESCRIPTION: 2 kOhms ±5% 0.25W, 1/4W Chip Resistor 0603 (1608 Metric) Automotive AEC-Q200, Pulse Withstanding Thick Film; DIGIKEY_PART_NUMBER: RHM2.0KDTR-ND; MF: Rohm; MP: ESR03EZPJ202; PACKAGE: 1608 Rohm Semiconductor; PURCHASE-URL: https://www.snapeda.com/api/url_track_click_mouser/?unipart_id=978373&manufacturer=Rohm&part_name=ESR03EZPJ202&search_term=None; SNAPEDA_LINK: https://www.snapeda.com/parts/ESR03EZPJ202/Rohm/view-part/?ref=snap
R17 = ESE323_Project_Library:RNCP0603FTD22K1; CHECK_PRICES: https://www.snapeda.com/parts/RNCP0603FTD22K1/Stackpole+Electronics+Inc/view-part/?ref=eda; DESCRIPTION: Res Thin Film 0603 22.1K Ohm 1% 0.125W(1/8W) ±100ppm/°C Sulfur Resistant Pad SMD T/R; DIGIKEY_PART_NUMBER: RNCP0603FTD22K1TR-ND; MF: Stackpole Electronics Inc; MP: RNCP0603FTD22K1; PACKAGE: 1508 Stackpole; PURCHASE-URL: https://www.snapeda.com/api/url_track_click_mouser/?unipart_id=3989807&manufacturer=Stackpole Electronics Inc&part_name=RNCP0603FTD22K1&search_term=None; SNAPEDA_LINK: https://www.snapeda.com/parts/RNCP0603FTD22K1/Stackpole+Electronics+Inc/view-part/?ref=snap
R18 = ESE323_Project_Library:RNCF0603DTE47K5; CHECK_PRICES: https://www.snapeda.com/parts/RNCF0603DTE47K5/Stackpole+Electronics+Inc/view-part/?ref=eda; DESCRIPTION: RES 47.5K OHM 0.5% 1/10W 0603; DIGIKEY_PART_NUMBER: 738-RNCF0603DTE47K5TR-ND; MF: Stackpole Electronics Inc; MP: RNCF0603DTE47K5; PACKAGE: 1508 Stackpole; PURCHASE-URL: https://www.snapeda.com/api/url_track_click_mouser/?unipart_id=3965254&manufacturer=Stackpole Electronics Inc&part_name=RNCF0603DTE47K5&search_term=None; SNAPEDA_LINK: https://www.snapeda.com/parts/RNCF0603DTE47K5/Stackpole+Electronics+Inc/view-part/?ref=snap
R19 = ESE323_Project_Library:RNCP0603FTD1K00; COPYRIGHT: Copyright (C) 2023 Ultra Librarian. All rights reserved.; MANUFACTURER_PART_NUMBER: RNCP0603FTD1K00; MFR_NAME: Stackpole International
R21 R22 = ESE323_Project_Library:RMCF0603ZT0R00; CHECK_PRICES: https://www.snapeda.com/parts/RMCF0603ZT0R00/Stackpole+Electronics+Inc/view-part/?ref=eda; DESCRIPTION: 0 Ohms Jumper 0.1W, 1/10W Chip Resistor 0603 (1608 Metric) Automotive AEC-Q200 Thick Film; DIGIKEY_PART_NUMBER: RMCF0603ZT0R00TR-ND; MF: Stackpole Electronics; MP: RMCF0603ZT0R00; PACKAGE: 0603 Stackpole Electronics; PURCHASE-URL: https://www.snapeda.com/api/url_track_click_mouser/?unipart_id=483594&manufacturer=Stackpole Electronics&part_name=RMCF0603ZT0R00&search_term=None; SNAPEDA_LINK: https://www.snapeda.com/parts/RMCF0603ZT0R00/Stackpole+Electronics+Inc/view-part/?ref=snap
R34 = ESE323_Project_Library:CD14ZT0R00; COPYRIGHT: Copyright (C) 2023 Ultra Librarian. All rights reserved.; MANUFACTURER_PART_NUMBER: CD14ZT0R00; MFR_NAME: Stackpole International
RESET S2 S3 = ESE323_Project_Library:TS04-66-50-BK-260-SMT; CHECK_PRICES: https://www.snapeda.com/parts/TS04-66-50-BK-260-SMT/CUI+Devices/view-part/?ref=eda; CUI_PURCHASE_URL: https://www.cuidevices.com/product/switches/tactile-switches/ts04-66-50-bk-260-smt?utm_source=snapeda.com&utm_medium=referral&utm_campaign=snapedaBOM; DESCRIPTION: 6 x 6 mm, 5 mm Actuator Height, 260 gf, Black, Surface Mount, SPST, Tactile Switch; DIGIKEY_PART_NUMBER: 2223-TS04-66-50-BK-260-SMT-ND; MF: CUI Devices; MP: TS04-66-50-BK-260-SMT; PACKAGE: None; PURCHASE-URL: https://www.snapeda.com/api/url_track_click_mouser/?unipart_id=8666142&manufacturer=CUI Devices&part_name=TS04-66-50-BK-260-SMT&search_term=None; SNAPEDA_LINK: https://www.snapeda.com/parts/TS04-66-50-BK-260-SMT/CUI+Devices/view-part/?ref=snap
U1 U2 U4 U5 = ESE323_Project_Library:AD8565AKSZ-REEL7; COPYRIGHT: Copyright (C) 2023 Ultra Librarian. All rights reserved.; MANUFACTURER_PART_NUMBER: AD8565AKSZ-REEL7; MFR_NAME: Analog Devices Inc
U3 = ESE323_Project_Library:LTC6910-3CTS8TRMPBF; COPYRIGHT: Copyright (C) 2023 Ultra Librarian. All rights reserved.; MANUFACTURER_PART_NUMBER: LTC6910-3CTS8#TRMPBF; MFR_NAME: Analog Devices Inc
U6 = ESE323_Project_Library:ADG1419BRMZ-REEL7; COPYRIGHT: Copyright (C) 2023 Ultra Librarian. All rights reserved.; MANUFACTURER_PART_NUMBER: ADG1419BRMZ-REEL7; MFR_NAME: Analog Devices Inc
U7 = ESE323_Project_Library:LMV331W5-7; COPYRIGHT: Copyright (C) 2023 Ultra Librarian. All rights reserved.; MANUFACTURER_PART_NUMBER: LMV331W5-7; MFR_NAME: Diodes Inc
U8 = ESE323_Project_Library:AZ1117CH-3.3TRG1; COPYRIGHT: Copyright (C) 2023 Ultra Librarian. All rights reserved.; MANUFACTURER_PART_NUMBER: AZ1117CH-3.3TRG1; MFR_NAME: Diodes Inc
U9 = ESE323_Project_Library:AD7819YRZ; COPYRIGHT: Copyright (C) 2023 Ultra Librarian. All rights reserved.; MANUFACTURER_PART_NUMBER: AD7819YRZ; MFR_NAME: Analog Devices Inc
U10 = ESE323_Project_Library:SN74LVC1G125DCKR; CHECK_PRICES: https://www.snapeda.com/parts/SN74LVC1G125DCKR/Texas+Instruments/view-part/?ref=eda; DESCRIPTION: Single 1.65-V to 5.5-V buffer with 3-state outputs; DIGIKEY_PART_NUMBER: 296-11604-2-ND; MF: Texas Instruments; MP: SN74LVC1G125DCKR; PACKAGE: SC70-5 Texas Instruments; PURCHASE-URL: https://www.snapeda.com/api/url_track_click_mouser/?unipart_id=105725&manufacturer=Texas Instruments&part_name=SN74LVC1G125DCKR&search_term=None; SNAPEDA_LINK: https://www.snapeda.com/parts/SN74LVC1G125DCKR/Texas+Instruments/view-part/?ref=snap
U11 = ESE323_Project_Library:DSC1001BE2-001.6000; COPYRIGHT: Copyright (C) 2023 Ultra Librarian. All rights reserved.; MANUFACTURER_PART_NUMBER: DSC1001BE2-001.6000; MFR_NAME: Microchip
U12 = ESE323_Project_Library:ESP32-WROOM-32; CHECK_PRICES: https://www.snapeda.com/parts/ESP32-WROOM-32/Espressif+Systems/view-part/?ref=eda; DESCRIPTION: Bluetooth, WiFi 802.11b/g/n, Bluetooth v4.2 +EDR, Class 1, 2 and 3 Transceiver Module 2.4GHz ~ 2.5GHz Antenna Not Included, U.FL Surface Mount; MF: Espressif Systems; MP: ESP32-WROOM-32; PACKAGE: Non Standard Espressif Systems; SNAPEDA_LINK: https://www.snapeda.com/parts/ESP32-WROOM-32/Espressif+Systems/view-part/?ref=snap
U13 = ESE323_Project_Library:CP2102N-A02-GQFN28R; CHECK_PRICES: https://www.snapeda.com/parts/CP2102N-A02-GQFN28R/Silicon+Labs/view-part/?ref=eda; DESCRIPTION: USB Bridge, USB to UART USB 2.0 UART Interface 28-QFN (5x5); DIGIKEY_PART_NUMBER: 336-5890-2-ND; MF: Silicon Labs; MP: CP2102N-A02-GQFN28R; PACKAGE: None; PURCHASE-URL: https://www.snapeda.com/api/url_track_click_mouser/?unipart_id=3595518&manufacturer=Silicon Labs&part_name=CP2102N-A02-GQFN28R&search_term=None; SNAPEDA_LINK: https://www.snapeda.com/parts/CP2102N-A02-GQFN28R/Silicon+Labs/view-part/?ref=snap
U14-U16 = ESE323_Project_Library:SN74LVC2G74DCUR; COPYRIGHT: Copyright (C) 2023 Ultra Librarian. All rights reserved.; MANUFACTURER_PART_NUMBER: SN74LVC2G74DCUR; MFR_NAME: Texas Instruments
USB1 = ESE323_Project_Library:1050170001; CHECK_PRICES: https://www.snapeda.com/parts/1050170001/Molex/view-part/?ref=eda; DESCRIPTION: USB - micro B USB 2.0 Receptacle Connector 5 Position Surface Mount, Right Angle; Through Hole; DIGIKEY_PART_NUMBER: WM1399TR-ND; MF: Molex; MP: 1050170001; PACKAGE: None; PURCHASE-URL: https://www.snapeda.com/api/url_track_click_mouser/?unipart_id=2755530&manufacturer=Molex&part_name=1050170001&search_term=None; SNAPEDA_LINK: https://www.snapeda.com/parts/1050170001/Molex/view-part/?ref=snap